# EAGLE design FLEXIBOARD (EAGLE 7.5.0)
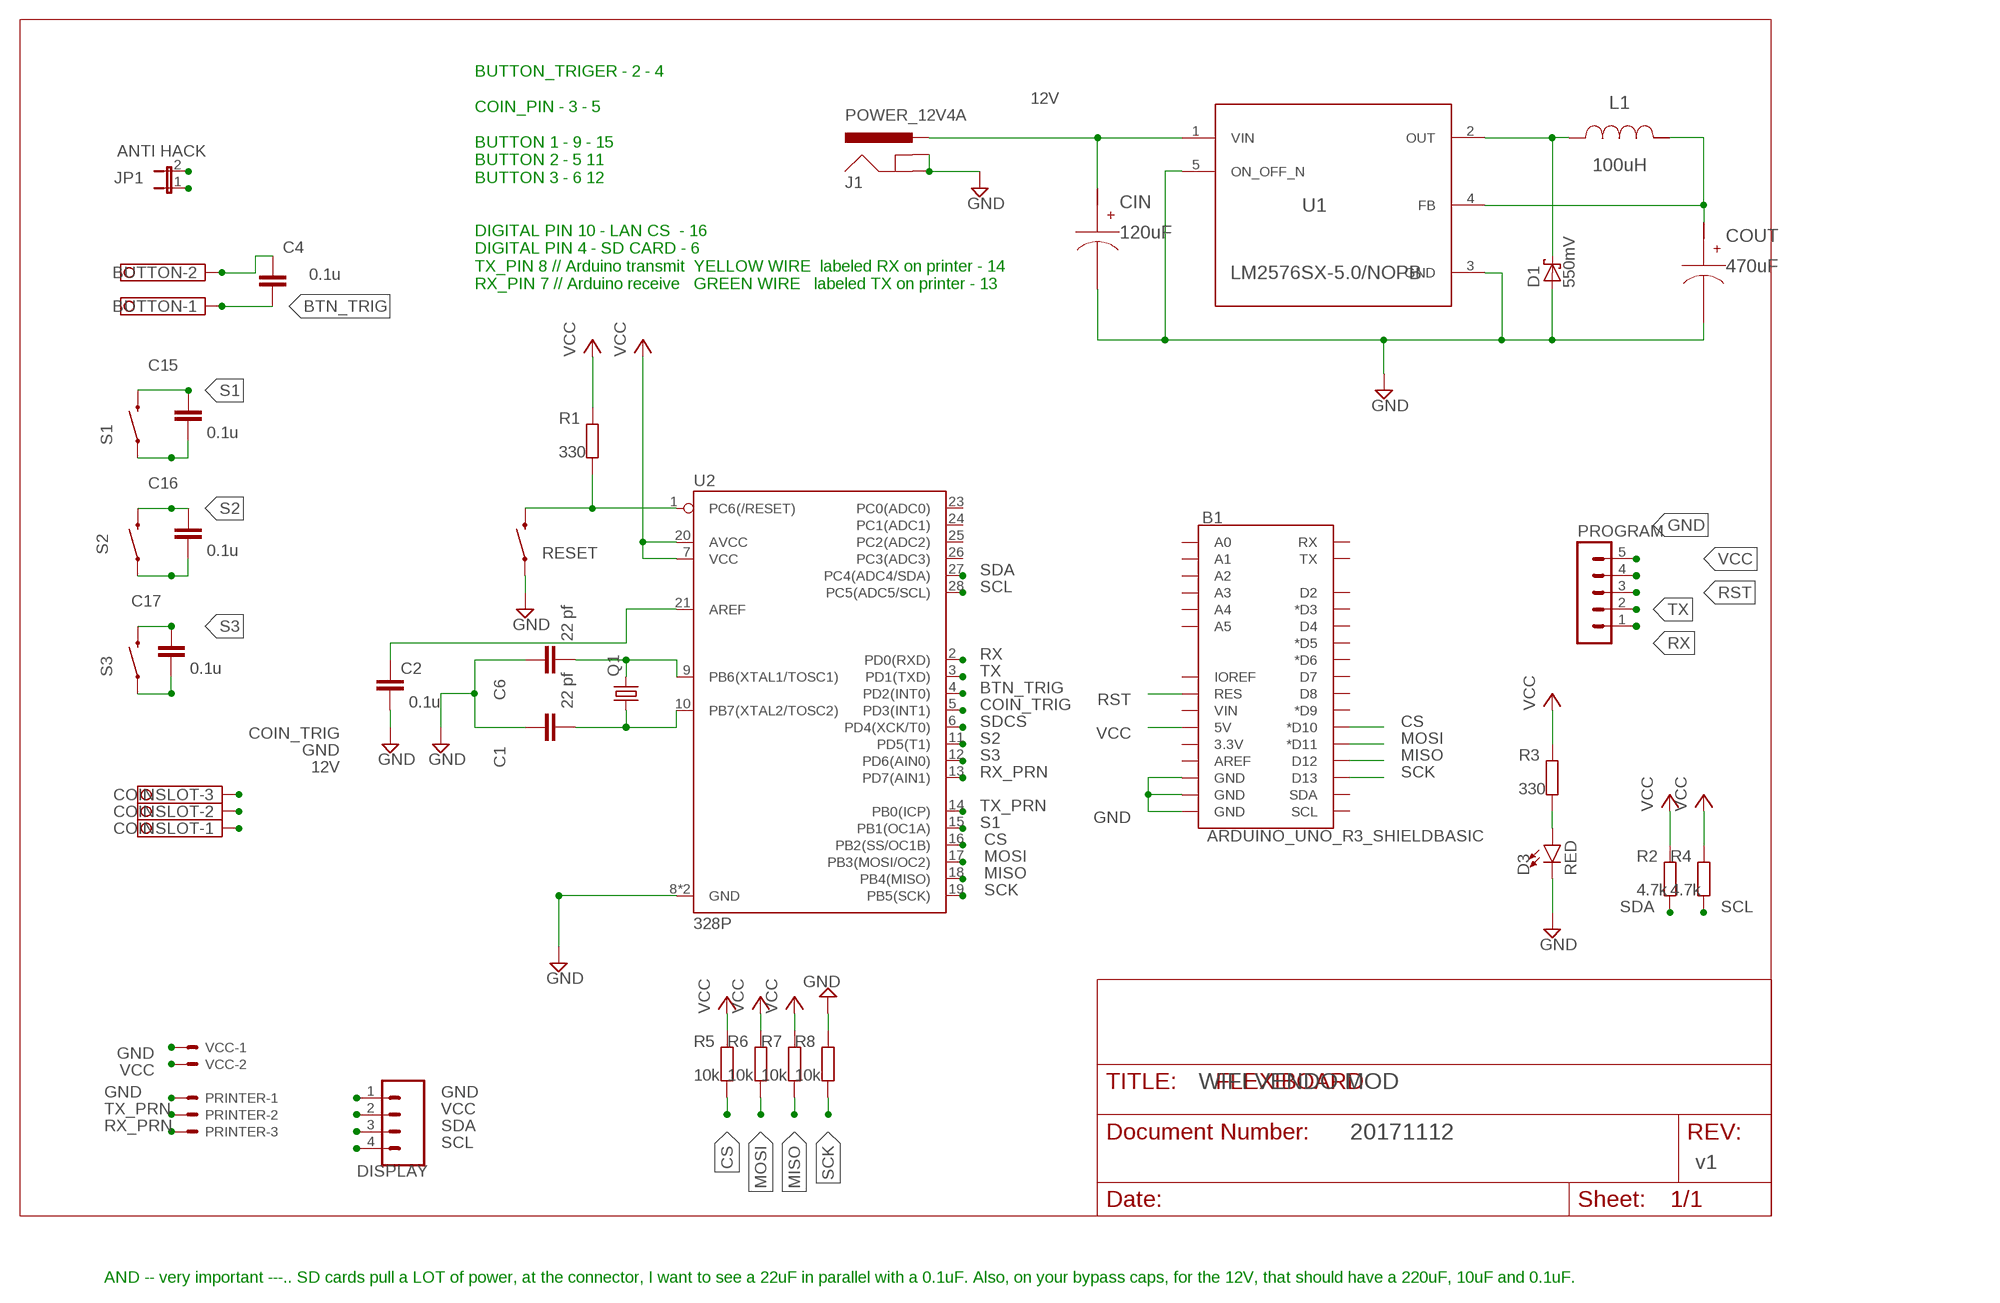
[diagram p0: schematic, sheet 1]

## Parts
B1  ARDUINO_UNO_R3_SHIELDBASIC  [UNO_R3_SHIELD]
BUTTON  TERMINAL-BLOCK-3.5MM-2-PIN-LONG-PAD  [TERMINAL-BLOCK-2-PIN-3.5MM-LONG-PAD]
C1  22 pf  C-EU050-024X044  [C050-024X044]
C2  0.1u  C-EU050-024X044  [C050-024X044]
C4  0.1u  C-EU050-024X044  [C050-024X044]
C6  22 pf  C-EU050-024X044  [C050-024X044]
C15  0.1u  C-EU050-024X044  [C050-024X044]
C16  0.1u  C-EU050-024X044  [C050-024X044]
C17  0.1u  C-EU050-024X044  [C050-024X044]
CIN  120uF  20SVPF120M  [CAPSMT_62_F61_T]
COINSLOT  TERMINAL-BLOCK-3.5MM-3-PIN-LONG-PAD  [TERMINAL-BLOCK-3-PIN-3.5MM-LONG-PAD]
COUT  470uF  EEE-FC1A471P  [SM_RADIAL_G_T]
D1  550mV  SCHOTTKY-DIODEC4111-15  [C4111-15]
D3  RED  LED5MM  [LED_5MM]
DISPLAY  M04PTH  [1X04]
J1  POWER_12V4A  POWER_JACKPTH  [POWER_JACK_PTH]
JP1  ANTI HACK  JUMPER-2SMD-NO  [SJ_2S-NO]
L1  100uH  PM2110-101K-RC  [PM2110]
PRINTER  JST-XH-03-PIN-LONG-PAD  [JST-XH-03-PACKAGE-LONG-PAD]
PROGRAM  MA05-1  [MA05-1]
Q1  CRYSTALSM49  [SM49]
R1  330  R-EU_0204/7  [0204/7]
R2  4.7k  R-EU_0204/7  [0204/7]
R3  330  R-EU_0204/7  [0204/7]
R4  4.7k  R-EU_0204/7  [0204/7]
R5  10k  R-EU_0204/7  [0204/7]
R6  10k  R-EU_0204/7  [0204/7]
R7  10k  R-EU_0204/7  [0204/7]
R8  10k  R-EU_0204/7  [0204/7]
RESET  SWITCH-MOMENTARY-2PTH_EZ  [TACTILE-PTH-EZ]
S1  SWITCH-MOMENTARY-2PTH_EZ  [TACTILE-PTH-EZ]
S2  SWITCH-MOMENTARY-2PTH_EZ  [TACTILE-PTH-EZ]
S3  SWITCH-MOMENTARY-2PTH_EZ  [TACTILE-PTH-EZ]
U1  LM2576SX-5.0/NOPB  [KTT0005B_T]
U2  328P  ATMEGA328P_PDIP  [DIP28]
VCC  JST-XH-02-PIN-LONG-PAD  [JST-XH-02-PACKAGE-LONG-PAD]

## Nets
12V: CIN.P$1(+) COINSLOT.1 J1.PWR U1.1(VIN)
BTN_TRIG: BUTTON.1 C4.2 U2.4(PD2(INT0))
COIN_TRIG: COINSLOT.3 U2.5(PD3(INT1))
CS: B1.D10(*D10) R5.1 U2.16(PB2(SS/OC1B))
GND: B1.GND@0(GND) B1.GND@1(GND) B1.GND@2(GND) BUTTON.2 C1.1 C2.2 C4.1 C6.1 C15.2 C16.2 C17.2 CIN.P$2(-) COINSLOT.2 COUT.P$2(-) D1.A D3.K(C) DISPLAY.1 J1.GND J1.GNDBREAK PRINTER.1 PROGRAM.5 R8.2 RESET.1 S1.1 S2.1 S3.1 U1.3(GND) U1.5(ON_OFF_N) U2.8(GND) U2.22(GND) VCC.1
MISO: B1.D12 R7.1 U2.18(PB4(MISO))
MOSI: B1.D11(*D11) R6.1 U2.17(PB3(MOSI/OC2))
N$1: C6.2 Q1.2 U2.9(PB6(XTAL1/TOSC1))
N$2: C1.2 Q1.1 U2.10(PB7(XTAL2/TOSC2))
N$4: D1.C L1.1 U1.2(OUT)
N$6: D3.A R3.1
N$7: C2.1 U2.21(AREF)
N$9: COUT.P$1(+) L1.2 U1.4(FB)
RST: B1.RES PROGRAM.3 R1.1 RESET.3 U2.1(PC6(/RESET))
RX: JP1.2 PROGRAM.1 U2.2(PD0(RXD))
RX_PRN: PRINTER.3 U2.13(PD7(AIN1))
S1: C15.1 S1.3 U2.15(PB1(OC1A))
S2: C16.1 S2.3 U2.11(PD5(T1))
S3: C17.1 S3.3 U2.12(PD6(AIN0))
SCK: B1.D13 R8.1 U2.19(PB5(SCK))
SCL: DISPLAY.4 R4.1 U2.28(PC5(ADC5/SCL))
SDA: DISPLAY.3 R2.1 U2.27(PC4(ADC4/SDA))
SDCS: U2.6(PD4(XCK/T0))
TX: JP1.1 PROGRAM.2 U2.3(PD1(TXD))
TX_PRN: PRINTER.2 U2.14(PB0(ICP))
VCC: B1.5V DISPLAY.2 PROGRAM.4 R1.2 R2.2 R3.2 R4.2 R5.2 R6.2 R7.2 U2.7(VCC) U2.20(AVCC) VCC.2
Unconnected: B1.3.3V B1.A0 B1.A1 B1.A2 B1.A3 B1.A4 B1.A5 B1.AREF B1.D2 B1.D3(*D3) B1.D4 B1.D5(*D5) B1.D6(*D6) B1.D7 B1.D8 B1.D9(*D9) B1.IOREF B1.RX B1.SCL B1.SDA B1.TX B1.VIN U2.23(PC0(ADC0)) U2.24(PC1(ADC1)) U2.25(PC2(ADC2)) U2.26(PC3(ADC3))

## Notes on the sheet
- BUTTON_TRIGER - 2 - 4
  
  COIN_PIN - 3 - 5
  
  BUTTON 1 - 9 - 15
  BUTTON 2 - 5 11
  BUTTON 3 - 6 12
  
  
  DIGITAL PIN 10 - LAN CS  - 16
  DIGITAL PIN 4 - SD CARD - 6
  TX_PIN 8 // Arduino transmit  YELLOW WIRE  labeled RX on printer - 14
  RX_PIN 7 // Arduino receive   GREEN WIRE   labeled TX on printer - 13
- WIFI VENDO MOD
- 20171112
- SCL
- v1
- AND -- very important ---.. SD cards pull a LOT of power, at the connector, I want to see a 22uF in parallel with a 0.1uF. Also, on your bypass caps, for the 12V, that should have a 220uF, 10uF and 0.1uF.

## Library data of the parts
B1 = SparkFun-Boards:ARDUINO_UNO_R3_SHIELD: Arduino R3 Shield Footprint Shield form compatible with the Arduino Uno R3. SparkFun Products: MG2639 Cellular Shield <https://www.sparkfun.com/products/13120> MIDI Shield <https://www.sparkfun.com/products/12898> R3 Stackable Headers Kit <https://www.sparkfun.com/products/11417>
BUTTON = Rembrandt Electronics - Terminal Block 3-5mm v1-0:TERMINAL-BLOCK-3.5MM-2-PIN: Terminal Block 3.5mm Pitch: 3,5 mm Number of pins: 2 Created by Rembrandt Electronics www.rembrandtelectronics.com
C1 C2 C4 C6 C15-C17 = resistor:C-EU: CAPACITOR, European symbol
CIN = AcceleratedDesigns_Lib:20SVPF120M
COINSLOT = Rembrandt Electronics - Terminal Block 3-5mm v1-0:TERMINAL-BLOCK-3.5MM-3-PIN: Terminal Block 3.5mm Pitch: 3,5 mm Number of pins: 3 Created by Rembrandt Electronics www.rembrandtelectronics.com
COUT = AcceleratedDesigns_Lib:EEE-FC1A471P
D1 = diode:SCHOTTKY-DIODE: Schottky Diode
D3 = SparkFun-LED:LED: LED (Generic) Standard schematic elements and footprints for 5mm, 3mm, 1206, and 0603 sized LEDs. Generic LEDs with no color specified.
DISPLAY = SparkFun-Connectors:M04: Header 4 Standard 4-pin 0.1" header. Use with straight break away headers (SKU : PRT-00116), right angle break away headers (PRT-00553), swiss pins (PRT-00743), machine pins (PRT-00117), and female headers (PRT-00115). Molex polarized connector foot print use with SKU : PRT-08231 with associated crimp pins and housings. 1MM SMD Version SKU: PRT-10208; PROD_ID: CONN-09696
J1 = SparkFun-Connectors:POWER_JACK: Power Jack This is the standard 5.5mm barrel jack for power. The PTH is the most common, proven, reliable, footprint. The Slot footprint only works if the mill layer is transmitted to the PCB fab house so be warned. Mating wall wart : TOL-00298 (and others); PROD_ID: CONN-08197
JP1 = SparkFun-Retired:JUMPER-2: Jumper Basic 0.1" spaced jumper. Use with breakaway headers.
L1 = AcceleratedDesigns_Lib:PM2110-101K-RC
PRINTER = Rembrandt Electronics - JST XH Connectors v1-0:JST-XH-03-PIN: JST XH Connector 2 Pin Wire to board connector. Pitch: 2,54 mm, (0.100") Number of pins: 3 Created by Rembrandt Electronics www.rembrandtelectronics.com
PROGRAM = con-lstb:MA05-1: PIN HEADER; OC_FARNELL: unknown; OC_NEWARK: unknown
Q1 = crystal:CRYSTAL: CRYSTAL; OC_FARNELL: unknown; OC_NEWARK: unknown
R1-R8 = resistor:R-EU_: RESISTOR, European symbol
RESET S1-S3 = SparkFun-Electromechanical:SWITCH-MOMENTARY-2: Various NO switches- pushbuttons, reed, etc
U1 = AcceleratedDesigns_Lib:LM2576SX-5.0/NOPB
U2 = SparkFun-IC-Microcontroller:ATMEGA328P_PDIP: Atmel 328P Through hole ATMEGA328P uC used in the Arduino 32kb flash, 1k EEPROM, 2k SRAM Datasheet <http://www.sparkfun.com/datasheets/Components/SMD/ATMega328.pdf> SparkFun Products Storefront component: AVR 28 Pin 20MHz 32K 6A/D - ATMega328P <https://www.sparkfun.com/products/9061> (COM-09061) SparkFun Simon Says - Through-Hole Soldering Kit <https://www.sparkfun.com/products/10547> (KIT-10547) SparkFun Learn to Solder - Simon Says <https://www.sparkfun.com/products/13708> (KIT-13708) SparkFun BigTime Watch Kit <https://www.sparkfun.com/products/11734> (KIT-11734) SparkFun ClockIt <https://www.sparkfun.com/products/10930> (KIT-10930) SparkFun Serial Enabled LCD Kit <https://www.sparkfun.com/products/10097> (LCD-10097) SparkFun Simon Tilts - Through Hole Soldering Kit <https://www.sparkfun.com/products/12634> (KIT-12634) SparkFun Frequency Counter Kit <https://www.sparkfun.com/products/10140> (KIT-10140) FabFM Radio Kit <https://www.sparkfun.com/products/11043> (KIT-11043) SparkFun Binary Blaster Kit <https://www.sparkfun.com/products/12037> (KIT-12037) SparkFun Metro-Gnome <https://www.sparkfun.com/products/9236> (KIT-09236) ATmega328 with Arduino Optiboot (Uno) <https://www.sparkfun.com/products/10524> (DEV-10524); PROD_ID: IC-09136
VCC = Rembrandt Electronics - JST XH Connectors v1-0:JST-XH-02-PIN: JST XH Connector 2 Pin Wire to board connector. Pitch: 2,54 mm, (0.100") Number of pins: 2 Created by Rembrandt Electronics www.rembrandtelectronics.com

## Net classes
0 default: width 0.406 mm

## Board
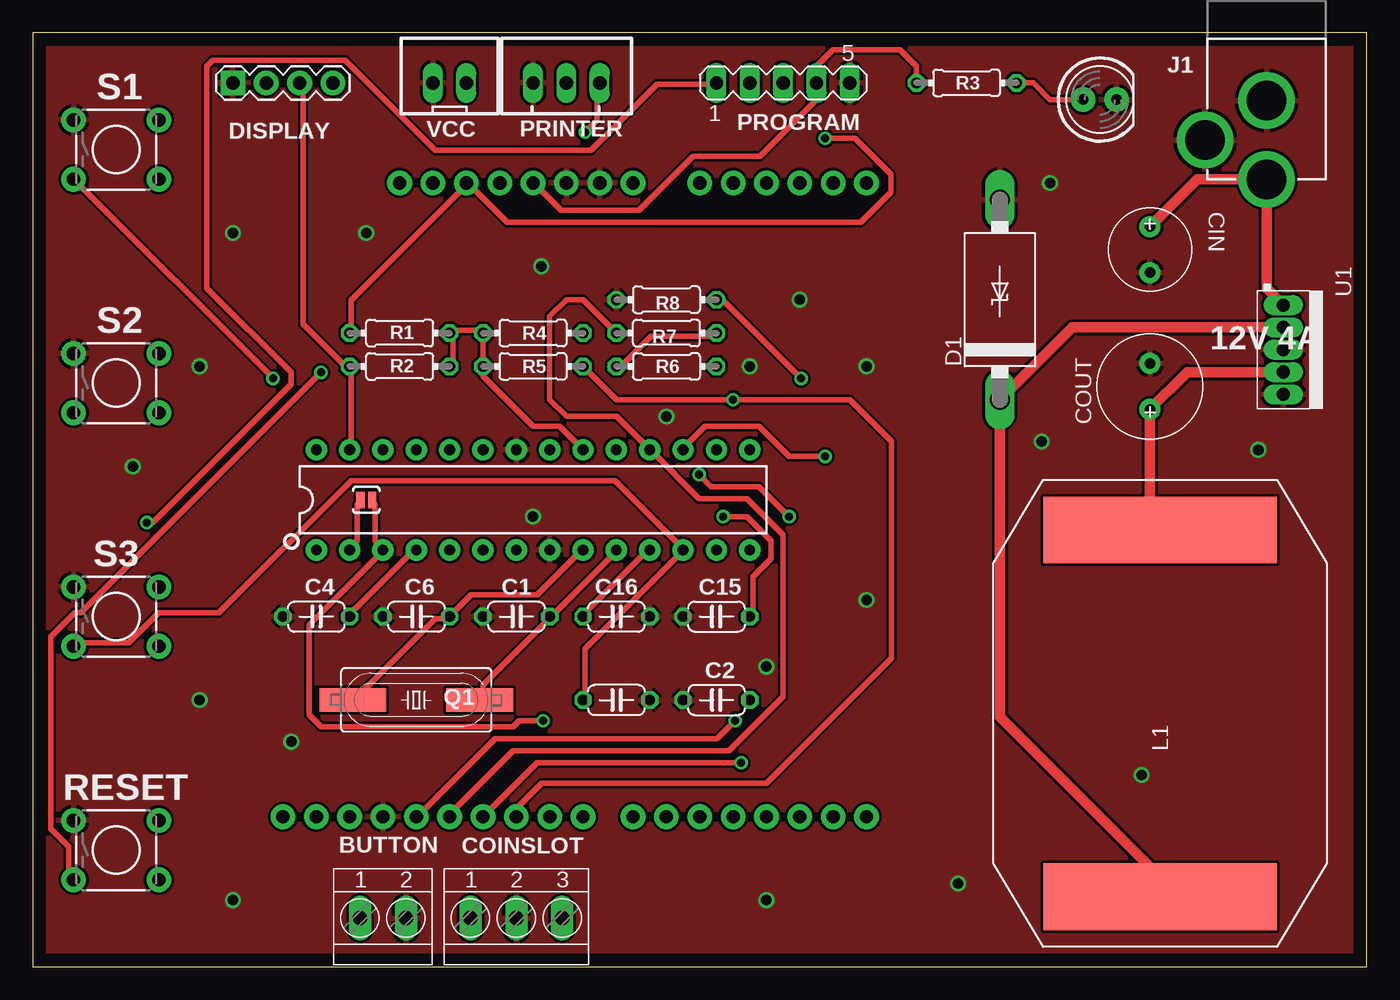
[diagram p1: board, top side]
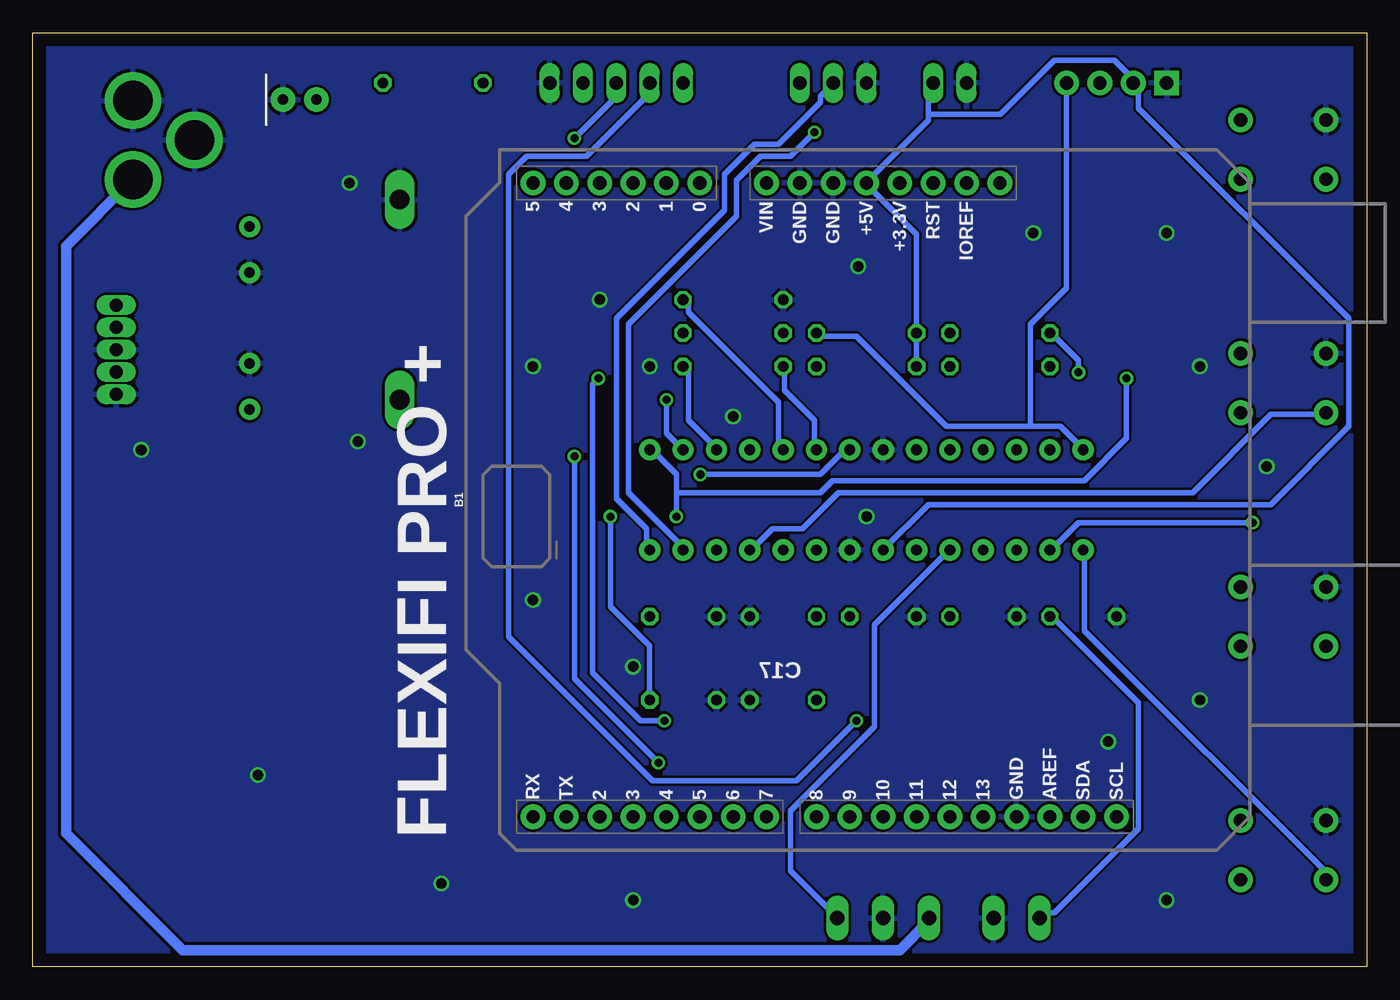
[diagram p2: board, bottom side, seen from below]

Size 101.6 x 71.12 mm. Coordinates in mm from the lower left corner, seen from the top.
Outline: 0,0 101.6,0 101.6,71.12 0,71.12 0,0
Copper layers (1*16): Top 0.035mm / dielectric 1.5mm / Bottom 0.035mm
Design rules "default *": minimum track width 10mil, minimum drill 24mil, track to track 8mil, track to pad 8mil, pad to pad 8mil, via to via 8mil, smd to smd 8mil, copper to edge 40mil, drill to drill 8mil, minimum pad ring 10mil, minimum via ring 8mil, stop-mask expansion 4mil, vias tented up to drill 0mil, thermal gap 10mil

### Footprints (pad centres in the part's own frame; a part is rotated, then mirrored left to right if it is on the bottom)
UNO_R3_SHIELD = drill 1.016 pad 1.88: 3.3V 24.13,-2.54; 5V 24.13,0; A0 24.13,12.7; A1 24.13,15.24; A2 24.13,17.78; A3 24.13,20.32; A4 24.13,22.86; A5 24.13,25.4; AREF -24.13,-13.97; D2 -24.13,20.32; D3 -24.13,17.78; D4 -24.13,15.24; D5 -24.13,12.7; D6 -24.13,10.16; D7 -24.13,7.62; D8 -24.13,3.81; D9 -24.13,1.27; D10 -24.13,-1.27; D11 -24.13,-3.81; D12 -24.13,-6.35; D13 -24.13,-8.89; GND@0 24.13,2.54; GND@1 24.13,5.08; GND@2 -24.13,-11.43; IOREF 24.13,-7.62; NC 24.13,-10.16; RES 24.13,-5.08; RX -24.13,25.4; SCL -24.13,-19.05; SDA -24.13,-16.51; TX -24.13,22.86; VIN 24.13,7.62
TERMINAL-BLOCK-2-PIN-3.5MM-LONG-PAD = drill 1.1 pad 1.7 long: 1 -1.75,-0.1; 2 1.75,-0.1
C050-024X044 = drill 0.813 octagon: 1 -2.54,0; 2 2.54,0
CAPSMT_62_F61_T = drill 0.8 pad 1.6: P$1 -1.75,0; P$2 1.75,0
TERMINAL-BLOCK-3-PIN-3.5MM-LONG-PAD = drill 1.1 pad 1.7 long: 1 -3.5,-0.1; 2 0,-0.1; 3 3.5,-0.1
SM_RADIAL_G_T = drill 0.8 pad 1.6: P$1 -1.75,0; P$2 1.75,0
C4111-15 = drill 1.499 long: A 7.62,0; C -7.62,0
LED_5MM = drill 0.813 pad 1.88: A -1.27,0; K 1.27,0
1X04 = drill 1.016 pad 1.88 square: 1 0,0 | drill 1.016 pad 1.88: 2 2.54,0; 3 5.08,0; 4 7.62,0
POWER_JACK_PTH = drill 2.997 pad 4.318: GND 0,7.7; GNDBREAK 4.7,10.7; PWR 0,13.7
SJ_2S-NO = smd 0.635 x 1.27: 1 -0.45,0; 2 0.45,0
PM2110 = smd 5.08 x 17.78: 1 -13.97,0; 2 13.97,0
JST-XH-03-PACKAGE-LONG-PAD = drill 1.016 long: 1 -2.54,0; 2 0,0; 3 2.54,0
MA05-1 = drill 1.016 long: 1 -5.08,0; 2 -2.54,0; 3 0,0; 4 2.54,0; 5 5.08,0
SM49 = smd 5.08 x 1.778: 1 -4.826,0; 2 4.826,0
0204/7 = drill 0.813 octagon: 1 -3.81,0; 2 3.81,0
TACTILE-PTH-EZ = drill 1.016 pad 1.88: 1 -3.251,2.261; 2 3.251,2.261; 3 -3.251,-2.261; 4 3.251,-2.261
KTT0005B_T = drill 1 pad 1.27 long: 1 0,3.4; 2 0,1.7; 3 0,0; 4 0,-1.7; 5 0,-3.4
DIP28 = drill 0.813 pad 1.626: 1 -16.51,-3.81; 2 -13.97,-3.81; 3 -11.43,-3.81; 4 -8.89,-3.81; 5 -6.35,-3.81; 6 -3.81,-3.81; 7 -1.27,-3.81; 8 1.27,-3.81; 9 3.81,-3.81; 10 6.35,-3.81; 11 8.89,-3.81; 12 11.43,-3.81; 13 13.97,-3.81; 14 16.51,-3.81; 15 16.51,3.81; 16 13.97,3.81; 17 11.43,3.81; 18 8.89,3.81; 19 6.35,3.81; 20 3.81,3.81; 21 1.27,3.81; 22 -1.27,3.81; 23 -3.81,3.81; 24 -6.35,3.81; 25 -8.89,3.81; 26 -11.43,3.81; 27 -13.97,3.81; 28 -16.51,3.81
JST-XH-02-PACKAGE-LONG-PAD = drill 1.016 long: 1 -1.27,0; 2 1.27,0

### Placement (x,y rotation side)
B1  38.1,35.56 90 bottom
BUTTON  26.67,3.81 0 top
C1  36.83,26.67 0 top
C2  52.07,20.32 180 top
C4  21.59,26.67 0 top
C6  29.21,26.67 0 top
C15  52.07,26.67 180 top
C16  44.45,26.67 0 top
C17  44.45,20.32 0 top
CIN  85.09,54.61 270 top
COINSLOT  36.83,3.81 0 top
COUT  85.09,44.2 90 top
D1  73.66,50.8 90 top
D3  81.28,66.04 0 top
DISPLAY  15.24,67.31 0 top
J1  93.98,73.66 180 top
JP1  25.4,35.56 180 top
L1  85.85,19.3 90 top
PRINTER  40.64,67.31 0 top
PROGRAM  57.15,67.31 0 top
Q1  29.21,20.32 180 top
R1  27.94,48.26 0 top
R2  27.94,45.72 0 top
R3  71.12,67.31 180 top
R4  38.1,48.26 180 top
R5  38.1,45.72 180 top
R6  48.26,45.72 180 top
R7  48.26,48.26 0 top
R8  48.26,50.8 180 top
RESET  6.35,8.89 0 top
S1  6.35,62.23 0 top
S2  6.35,44.45 0 top
S3  6.35,26.67 0 top
U1  95.25,46.99 0 top
U2  38.1,35.56 0 top
VCC  31.75,67.31 0 top

### Tracks (layer width: path | path; a pad name or v marks a point on that pad's centre or on a via)
12V
  Top 0.813: U1.1 93.98,51.66 J1.PWR 88.69,59.96 CIN.P$1
  Bottom 0.813: J1.PWR 99.06,54.88 99.06,10.16 90.17,1.27 35.56,1.27 33.33,3.5 COINSLOT.1
BTN_TRIG
  Top 0.406: C4.2 24.23,26.98 28.8,31.55 U2.4
  Bottom 0.406: BUTTON.1 24.69,4.12 23.77,4.12 17.37,10.52 17.37,20.12 23.77,26.52 C4.2
COIN_TRIG
  Bottom 0.406: U2.5 32,31.55 37.49,26.06 37.49,18.29 43.89,11.89 43.89,7.32 40.69,4.12 COINSLOT.3
CS  (via drill 0.6)
  Top 0.406: R5.1 44.45,43.18 v53.34,43.18 62.23,43.18 65.41,40.01 65.41,23.5 55.88,13.97 38.73,13.97 36.83,12.06 B1.D10
  Bottom 0.406: v53.34,43.18 53.34,40.64 U2.16
GND  (via drill 0.8)
  other vias: 25.4,55.88 7.62,38.1 58.42,50.8 63.5,45.72 63.5,27.94 15.24,55.88 12.7,45.72 12.7,20.32 15.24,5.08 55.88,5.08 55.88,22.86 48.26,41.91 54.61,45.72 38.1,34.29 84.45,14.61 70.48,6.35 93.34,39.37 76.83,40.01 77.47,59.69 38.73,53.34 19.68,17.14
  pour Top: -19.05,88.9 120.65,88.9 120.65,-19.05 -19.05,-19.05
  pour Bottom: -12.7,82.55 114.3,82.55 114.3,-12.7 -12.7,-12.7
MISO
  Top 0.406: B1.D12 32,11.43 32,11.89 36.58,16.46 53.03,16.46 57.15,20.57 57.15,32.92 54.41,35.66 50.75,35.66 47.09,39.32 U2.18 46.63,39.78 46.58,39.78 44.45,41.91 40.64,41.91 39.37,43.18 39.37,49.53 40.64,50.8 41.91,50.8 R7.1
MOSI  (via drill 0.61)
  Top 0.406: B1.D11 38.41,15.54 v53.95,15.54 | v60.35,38.86 57.61,38.86 55.32,41.15 51.21,41.15 49.84,39.78 U2.17
  Bottom 0.406: R6.1 51.66,45.72 51.66,41.6 49.84,39.78 U2.17 | v53.95,15.54 60.35,21.95 v60.35,38.86
N$1
  Top 0.406: Q1.2 24.69,20.57 30.63,26.52 31.55,26.52 C6.2 32,26.98 33.38,28.35 38.41,28.35 41.6,31.55 U2.9
N$2
  Top 0.406: U2.10 44.35,31.55 39.78,26.98 C1.2 39.32,26.52 34.29,21.49 34.29,20.57 Q1.1
N$4
  Top 0.813: U1.2 79.17,48.69 D1.C 73.66,19.05 85.85,6.86 L1.1
N$6
  Top 0.406: R3.1 76.2,67.31 77.47,66.04 D3.A
N$7  (via drill 0.61)
  Top 0.406: v57.61,34.29 55.32,36.58 51.66,36.58 v50.75,37.49
  Bottom 0.406: v57.61,34.29 57.61,27.43 54.61,24.43 C2.1 | v50.75,37.49 41.6,37.49 39.78,39.32 U2.21
N$9
  Top 0.813: U1.4 87.93,45.29 COUT.P$1 85.09,34.29 85.85,33.53 L1.2
RST  (via drill 0.61)
  Top 0.406: R1.1 24.23,48.46 24.23,50.75 32.92,59.44 B1.RES 33.38,59.44 36.12,56.69 63.09,56.69 65.38,58.98 65.38,60.35 62.64,63.09 v60.35,63.09 | v21.95,45.26 3.66,26.98 3.2,26.98 1.37,25.15 1.37,10.52 2.74,9.14 2.74,6.86 RESET.3
  Bottom 0.406: U2.1 21.49,31.55 21.49,25.6 2.74,6.86 RESET.3 | PROGRAM.3 57.15,66.29 v60.35,63.09 | v21.95,45.26 21.95,46.18 23.77,48.01 R1.1
RX  (via drill 0.61)
  Top 0.406: JP1.2 24.69,35.2 24.69,32.46 24.23,32 U2.2 | v8.69,33.83 9.14,33.83 19.66,44.35 19.66,45.26 13.26,51.66 13.26,68.58 13.72,69.04 23.77,69.04 30.63,62.18 42.52,62.18 47.55,67.21 51.66,67.21 PROGRAM.1
  Bottom 0.406: v8.69,33.83 21.95,33.83 23.77,32 U2.2
RX_PRN  (via drill 0.61)
  Top 0.406: v42.06,63.55 42.98,64.47 42.98,67.21 PRINTER.3
  Bottom 0.406: v42.06,63.55 43.89,61.72 46.18,61.72 48.01,59.89 48.01,57.15 56.24,48.92 56.24,36.12 52.12,32 U2.13
S1  (via drill 0.61)
  Top 0.406: v52.58,34.29 54.41,34.29 56.24,32.46 56.24,31.09 54.86,29.72 54.86,26.98 C15.1 | v18.29,44.81 3.2,59.89 S1.3
  Bottom 0.406: 52.58,36.12 52.58,37.49 54.41,39.32 U2.15 | 52.58,36.12 v52.58,34.29 | v18.29,44.81 18.29,40.23 21.49,37.03 40.69,37.03 41.6,36.12 52.58,36.12
S2
  Top 0.406: C16.1 42.06,26.98 46.63,31.55 U2.11
  Bottom 0.406: S2.3 3.2,42.06 7.32,42.06 13.26,36.12 40.23,36.12 42.98,33.38 45.26,33.38 46.63,32 U2.11
S3
  Top 0.406: C17.1 42.06,20.57 42.06,24.23 49.38,31.55 U2.12 49.38,32 44.35,37.03 24.23,37.03 14.17,26.98 9.6,26.98 7.32,24.69 3.2,24.69 S3.3
SCK  (via drill 0.61)
  Top 0.406: v53.49,18.75 52.12,17.37 35.2,17.37 29.26,11.43 B1.D13 | v58.52,44.81 52.12,51.21 R8.1
  Bottom 0.406: R8.1 51.66,50.75 51.66,49.84 44.81,42.98 44.81,39.78 U2.19 | v53.49,18.75 55.32,18.75 58.98,22.4 58.98,44.35 v58.52,44.81
SCL
  Bottom 0.406: 25.6,41.15 23.32,41.15 21.95,39.78 U2.28 | 25.6,41.15 32,41.15 38.86,48.01 41.6,48.01 R4.1 | DISPLAY.4 22.86,51.66 25.6,48.92 25.6,41.15
SDA
  Top 0.406: U2.27 24.23,39.78 24.23,45.72 R2.1 23.77,45.72 20.57,48.92 20.57,67.21 DISPLAY.3
TX  (via drill 0.61)
  Top 0.406: JP1.1 26.06,35.2 26.06,32.46 26.52,32 U2.3 26.52,31.55 21.03,26.06 21.03,19.2 21.95,18.29 36.58,18.29 37.03,18.75 v38.86,18.75
  Bottom 0.406: v38.86,18.75 43.43,14.17 54.41,14.17 65.38,25.15 65.38,60.35 64.01,61.72 59.44,61.72 54.86,66.29 54.86,67.21 PROGRAM.2
TX_PRN
  Bottom 0.406: PRINTER.2 40.69,67.21 41.6,66.29 41.6,65.84 44.81,62.64 46.63,62.64 48.92,60.35 48.92,57.61 57.15,49.38 57.15,35.66 54.86,33.38 54.86,32 U2.14
VCC
  Top 0.406: R7.2 51.66,48.01 47.09,48.01 44.81,45.72 R6.2 | R2.2 32,45.72 32,48.01 R1.2 32,48.46 34.29,48.46 R4.2 R5.2 34.29,44.96 38.1,41.15 40.13,41.15 U2.20 | B1.5V 38.41,59.44 40.23,57.61 46.18,57.61 50.29,61.72 55.37,61.72 59.69,66.04 PROGRAM.4 59.69,68.58 60.96,69.85 66.04,69.85 67.31,68.58 R3.2
  Bottom 0.406: R6.2 44.35,45.72 44.35,43.89 42.06,41.6 42.06,39.78 U2.20 | 33.38,64.92 33.38,64.47 37.95,59.89 B1.5V 37.95,59.44 34.29,55.78 R5.2 | 33.38,64.92 33.38,67.21 VCC.2 | U2.7 33.38,35.2 7.32,35.2 1.37,41.15 1.37,49.38 17.37,65.38 17.37,67.21 DISPLAY.2 17.83,67.67 19.2,69.04 23.77,69.04 27.89,64.92 33.38,64.92

### Text on the board
tPlace: 12V 4A
bPlace: FLEXIFI PRO +